# Altium project Red_Lion_Pro_ProjFile.PrjPcb
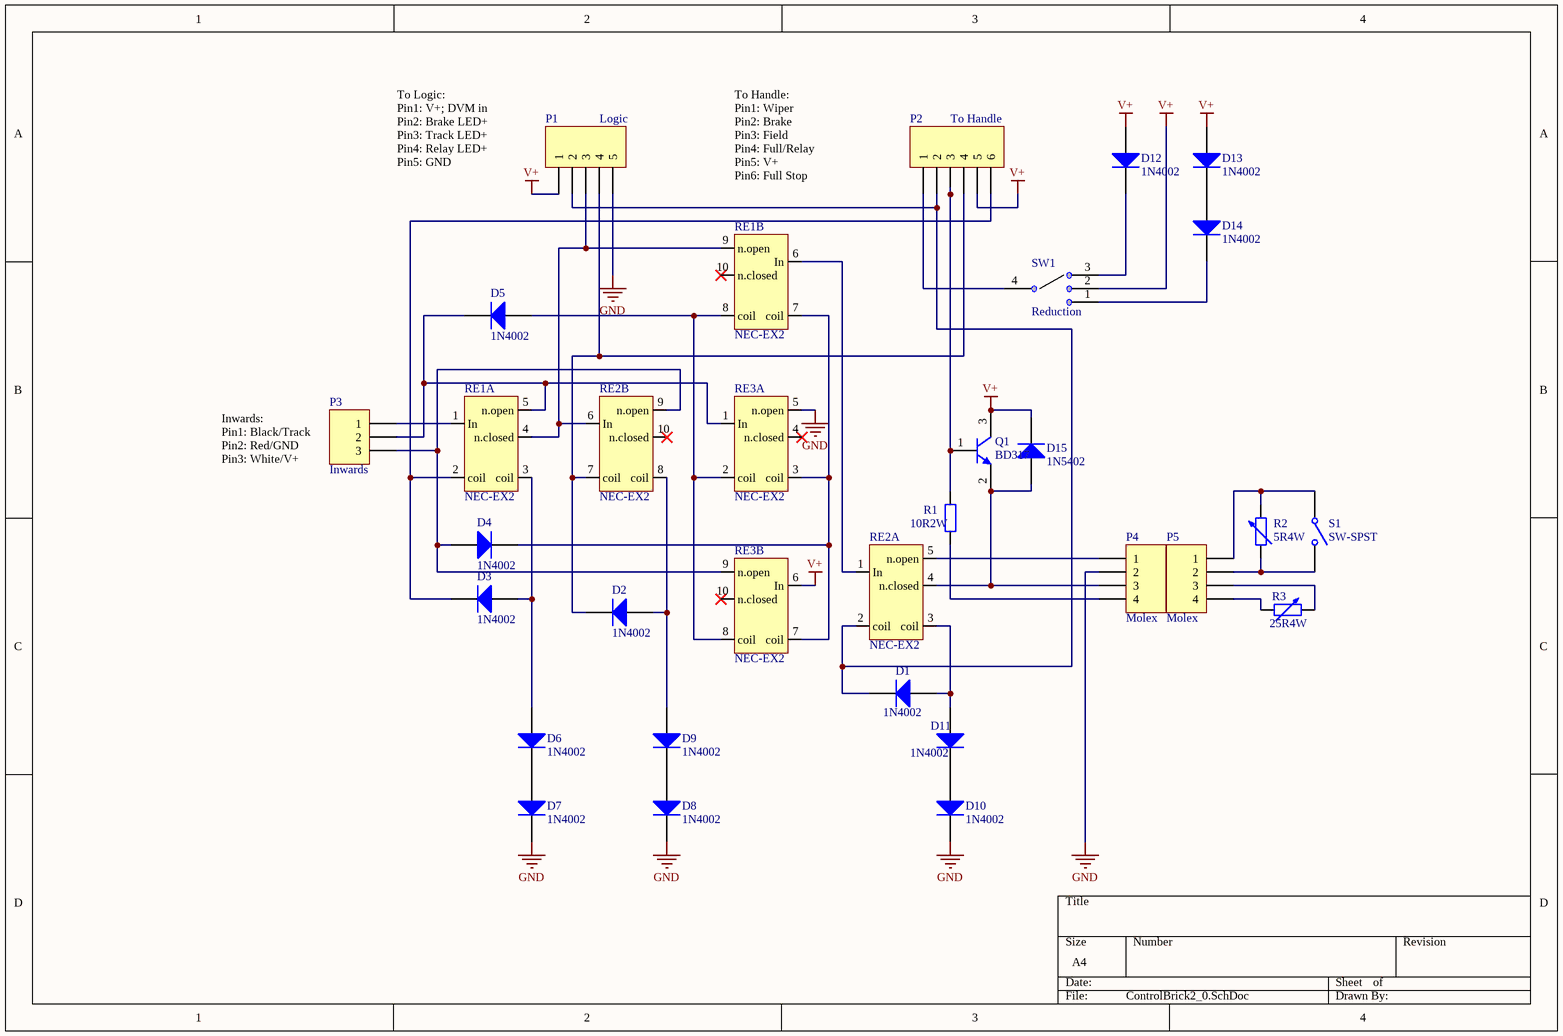
[diagram p0: ControlBrick2_0.SchDoc]
3 sheets, 103 parts. Net scope: global (net labels, ports and power ports of the same name join across sheets).
Board files: BaseBoard.PcbDoc, ControlBrick2_0.PcbDoc, ControlBrickFaceplate.PcbDoc, ControlBrickLogic2_0.PcbDoc, ControlBrickRiser.PcbDoc, Handle.PcbDoc, Holder.PcbDoc, ResistorCard32.5.PcbDoc, ResistorCard40.PcbDoc, ResistorCard50.PcbDoc, ResistorCard60.PcbDoc, ResistorCard67.5.PcbDoc, ResistorCard82.5.PcbDoc, ResistorCard97.5.PcbDoc, ResistorCard127.5.PcbDoc, ResistorCard140.PcbDoc, ResistorCard170.PcbDoc, ResistorCard187.5.PcbDoc, ResistorCard205.PcbDoc, ResistorCardAny.PcbDoc, Wiper.PcbDoc
Sheets:
  ControlBrick2_0.SchDoc
  ControlBrickLogic2_0.SchDoc
  Handle.SchDoc

## Sheet ControlBrick2_0.SchDoc
size A4

### Parts
D1  1N4002  [StdDiode]
D2  1N4002  [StdDiode]
D3  1N4002  [StdDiode]
D4  1N4002  [StdDiode]
D5  1N4002  [StdDiode]
D6  1N4002  [StdDiode]
D7  1N4002  [StdDiode]
D8  1N4002  [StdDiode]
D9  1N4002  [StdDiode]
D10  1N4002  [StdDiode]
D11  1N4002  [StdDiode]
D12  1N4002  [StdDiode]
D13  1N4002  [StdDiode]
D14  1N4002  [StdDiode]
D15  1N5402  [BigDiode]
P1  Logic  [HDR1X5]
P2  To Handle  [Interconnect]
P3  Inwards  [Inwards]
P4  Molex  [Molex_4x50.8]
P5  Molex  [HDR1X4]
Q1  BD317  [TO-3]
R1  10R2W  [2Wres]
R2  value 5R4W  [AXIAL-0.6]  (hidden comment: Res Adj2)
R3  value 25R4W  [AXIAL-0.6]  (hidden comment: Res Adj2)
RE1  NEC-EX2  [NEC-EX2]  (parts A,B of 2)
RE2  NEC-EX2  [NEC-EX2]  (parts A,B of 2)
RE3  NEC-EX2  [NEC-EX2]  (parts A,B of 2)
S1  SW-SPST  [Switch SPST]
SW1  Reduction  [Switch SP3T]

### Nets
GND: D7.2(K) D8.2(K) D10.2(K) P1.5 P4.2 RE3.5(n.open)
V+: D12.1(A) D13.1(A) D15.2(K) P1.1 P2.5 Q1.3(C) RE3.6(In) SW1.2
NetD1_1: D1.1(A) D11.1(A) RE2.3(coil)
NetD1_2: D1.2(K) P1.2 P2.2 RE2.2(coil)
NetD2_1: D2.1(A) D9.1(A) RE2.8(coil)
NetD2_2: D2.2(K) P1.4 P2.4 RE2.7(coil)
NetD3_1: D3.1(A) D6.1(A) RE1.3(coil)
NetD3_2: D3.2(K) P2.6 RE1.2(coil)
NetD4_1: D4.1(A) P3.3 RE2.9(n.open) RE3.9(n.open)
NetD4_2: D4.2(K) RE1.7(coil) RE3.3(coil) RE3.7(coil)
NetD5_1: D5.1(A) RE1.8(coil) RE3.2(coil) RE3.8(coil)
NetD5_2: D5.2(K) P3.2 RE1.5(n.open) RE3.1(In)
NetD6_2: D6.2(K) D7.1(A)
NetD8_1: D8.1(A) D9.2(K)
NetD10_1: D10.1(A) D11.2(K)
NetD12_2: D12.2(K) SW1.3
NetD13_2: D13.2(K) D14.1(A)
NetD14_2: D14.2(K) SW1.1
NetD15_1: D15.1(A) P4.3 Q1.2(E) RE2.4(n.closed)
NetP1_3: P1.3 RE1.4(n.closed) RE1.9(n.open) RE2.6(In)
NetP2_1: P2.1 SW1.4
NetP2_3: P2.3 Q1.1(B) R1.2
NetP3_1: P3.1 RE1.1(In)
NetP4_1: P4.1 RE2.5(n.open)
NetP4_4: P4.4 R1.1
NetP5_1: P5.1 R2.2 S1.1(COMMON)
NetP5_2: P5.2 R2.1 S1.2(NO)
NetP5_3: P5.3 R3.2
NetP5_4: P5.4 R3.1
NetRE1_6: RE1.6(In) RE2.1(In)

Not connected (* = marked no-connect by the designer): RE1 10(n.closed)*; RE2 10(n.closed)*; RE3 4(n.closed)* 10(n.closed)*

### Notes on the sheet
- (near P1) To Logic:
  Pin1: V+; DVM in
  Pin2: Brake LED+
  Pin3: Track LED+
  Pin4: Relay LED+
  Pin5: GND
- To Handle:
  Pin1: Wiper
  Pin2: Brake
  Pin3: Field
  Pin4: Full/Relay
  Pin5: V+
  Pin6: Full Stop
- Inwards:
  Pin1: Black/Track
  Pin2: Red/GND
  Pin3: White/V+

### Library data of the parts
D1-D14 = Diode 1N4002: 1 Amp General Purpose Rectifier; Published: 8-Jun-2000; LatestRevisionDate: 17-Jul-2002; LatestRevisionNote: Re-released for DXP Platform.; DatasheetVersion: 1998; PackageVersion: Aug-1999; PackageReference: DO-41; Publisher: Altium Limited; PackageDescription: Diode, Axial; Body 5.2 x 2.7 mm (LxDia. max), Lead Dia. 0.86 mm (max); Code_JEDEC: DO-204-AL; ComponentLink1Description: Manufacturer Link; ComponentLink1URL: http://www.fairchildsemi.com/; ComponentLink2Description: Datasheet; ComponentLink2URL: http://www.fairchildsemi.com/ds/1N%2F1N4001.pdf
D15 = Diode 1N5402: 3 Amp General Purpose Rectifier; Published: 8-Jun-2000; LatestRevisionDate: 17-Jul-2002; LatestRevisionNote: Re-released for DXP Platform.; DatasheetVersion: 1998; PackageVersion: Aug-1999; PackageReference: DO-201AD; Publisher: Altium Limited; PackageDescription: Diode, Axial; Body 9.5 x 5.6 mm (LxDia. max), Lead Dia. 1.32 mm (max); ComponentLink1Description: Manufacturer Link; ComponentLink1URL: http://www.fairchildsemi.com/; ComponentLink2Description: Datasheet; ComponentLink2URL: http://www.fairchildsemi.com/ds/1N%2F1N5400.pdf
P1 = Header 5: Header, 5-Pin; LatestRevisionDate: 17-Jul-2002; LatestRevisionNote: Re-released for DXP Platform.; Publisher: Altium Limited
P2 = Header 6: Header, 6-Pin; LatestRevisionDate: 17-Jul-2002; LatestRevisionNote: Re-released for DXP Platform.; Publisher: Altium Limited
P3 = Header 3: Header, 3-Pin; LatestRevisionDate: 17-Jul-2002; LatestRevisionNote: Re-released for DXP Platform.; Publisher: Altium Limited
P4 P5 = Header 4: Header, 4-Pin; LatestRevisionDate: 17-Jul-2002; LatestRevisionNote: Re-released for DXP Platform.; Publisher: Altium Limited
Q1 = 2N3904: NPN General Purpose Amplifier; Published: 8-Jun-2000; LatestRevisionDate: 15-Jan-2003; LatestRevisionNote: PCB Footprint 'BCY-W3/D4.7' replaced; DatasheetVersion: 1997; PackageVersion: Sep-1998; PackageReference: TO-92A; Publisher: Altium Limited; PackageDescription: TO, Flat Index; 3 In-Line, Axial Leads; Body Dia. 4.5mm; Leads 0.51 x 0.48 mm (max); ComponentLink1Description: Manufacturer Link; ComponentLink1URL: http://www.fairchildsemi.com/; ComponentLink2Description: Datasheet; ComponentLink2URL: http://www.fairchildsemi.com/ds/2N%2F2N3904.pdf
R1 = Res2: Resistor; Published: 8-Jun-2000; LatestRevisionDate: 17-Jul-2002; LatestRevisionNote: Re-released for DXP Platform.; PackageReference: AXIAL-0.4; Publisher: Altium Limited; PackageDescription: Axial Device, Thru-Hole; 2 Leads; 0.4 in Pin Spacing
R2 R3 = Res Adj2: Variable Resistor; Set Position: 0.5; Published: 8-Jun-2000; LatestRevisionDate: 17-Jul-2002; LatestRevisionNote: Re-released for DXP Platform.; PackageReference: AXIAL-0.6; Publisher: Altium Limited; PackageDescription: Axial Device, Thru-Hole; 2 Leads; 0.6 in Pin Spacing
RE1 RE2 = Component_2
RE3 = NEC-EX2-2U1S
S1 = SW-SPST: Single-Pole, Single-Throw Switch; Published: 24-Mar-1999; LatestRevisionDate: 17-Jul-2002; LatestRevisionNote: Re-released for DXP Platform.; PackageReference: SPST-2; Publisher: Altium Limited; PackageDescription: Switch; 2 Leads
SW1 = 3Way

## Sheet ControlBrickLogic2_0.SchDoc
size A4
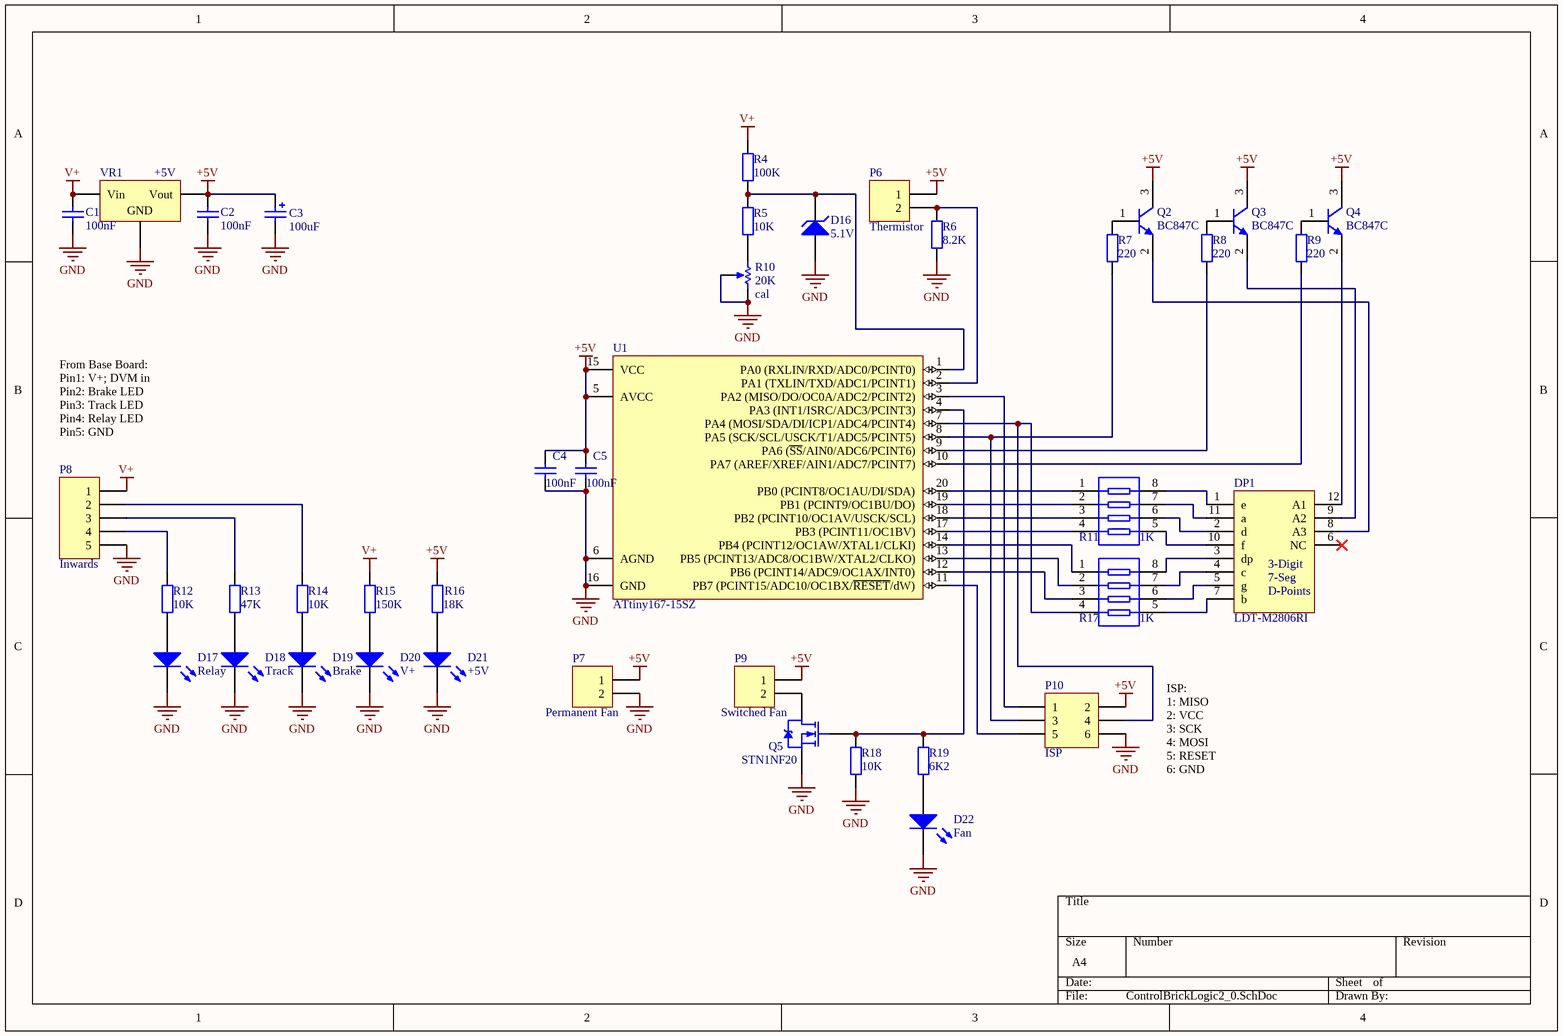
[diagram p1: ControlBrickLogic2_0.SchDoc]

### Parts
C1  value 100nF  [1206]  (hidden comment: CapSMD)
C2  value 100nF  [1206]  (hidden comment: CapSMD)
C3  value 100uF  [SMDcap 5mm]  (hidden comment: Supercap)
C4  value 100nF  [1206]  (hidden comment: CapSMD)
C5  value 100nF  [1206]  (hidden comment: CapSMD)
D16  5.1V  [MiniMELF]
D17  Relay  [LED 2.54]
D18  Track  [LED 2.54]
D19  Brake  [LED 2.54]
D20  V+  [LED 2.54]
D21  +5V  [LED 2.54]
D22  Fan  [LED 2.54]
DP1  LDT-M2806RI  [LDT-M2806RI]
P6  Thermistor  [HDR1X2]
P7  Permanent Fan  [HDR1X2]
P8  Inwards  [HDR1X5]
P9  Switched Fan  [HDR1X2]
P10  ISP  [HDR2X3]
Q2  BC847C  [SOT23]
Q3  BC847C  [SOT23]
Q4  BC847C  [SOT23]
Q5  STN1NF20  [SOT223]
R4  value 100K  [1206]  (hidden comment: ResSMD)
R5  value 10K  [1206]  (hidden comment: ResSMD)
R6  value 8.2K  [1206]  (hidden comment: ResSMD)
R7  value 220  [1206]  (hidden comment: ResSMD)
R8  value 220  [1206]  (hidden comment: ResSMD)
R9  value 220  [1206]  (hidden comment: ResSMD)
R10  cal  value 20K  [Tr3296P]
R11  1K  [ResNet1206_8]
R12  value 10K  [1206]  (hidden comment: ResSMD)
R13  value 47K  [1206]  (hidden comment: ResSMD)
R14  value 10K  [1206]  (hidden comment: ResSMD)
R15  value 150K  [1206]  (hidden comment: ResSMD)
R16  value 18K  [1206]  (hidden comment: ResSMD)
R17  1K  [ResNet1206_8]
R18  value 10K  [1206]  (hidden comment: ResSMD)
R19  value 6K2  [1206]  (hidden comment: ResSMD)
U1  ATtiny167-15SZ  [20TG_N]
VR1  +5V  [DPAK]

### Nets
+5V: C2.2 C3.1 C4.2 C5.2 P6.1 P7.1 P9.1 P10.2 Q2.3(C) Q3.3(C) Q4.3(C) R16.2 U1.5(AVCC) U1.15(VCC) VR1.3(Vout)
GND: C1.1 C2.1 C3.2 C4.1 C5.1 D16.1(A) D17.2(K) D18.2(K) D19.2(K) D20.2(K) D21.2(K) D22.2(K) P7.2 P8.5 P10.6 Q5.3(S) R6.1 R10.2(BOT) R10.3(TAP) R18.1 U1.6(AGND) U1.16(GND) VR1.2(GND)
V+: C1.2 P8.1 R4.2 R15.2 VR1.1(Vin)
NetD16_2: D16.2(K) R4.1 R5.2 U1.1(PA0_(RXLIN/RXD/ADC0/PCINT0))
NetD17_1: D17.1(A) R12.1
NetD18_1: D18.1(A) R13.1
NetD19_1: D19.1(A) R14.1
NetD20_1: D20.1(A) R15.1
NetD21_1: D21.1(A) R16.1
NetD22_1: D22.1(A) R19.1
NetDP1_1: DP1.1(e) R11.8
NetDP1_2: DP1.2(d) R11.6
NetDP1_3: DP1.3(dp) R17.8
NetDP1_4: DP1.4(c) R17.7
NetDP1_5: DP1.5(g) R17.6
NetDP1_7: DP1.7(b) R17.5
NetDP1_8: DP1.8(A3) Q2.2(E)
NetDP1_9: DP1.9(A2) Q3.2(E)
NetDP1_10: DP1.10(f) R11.5
NetDP1_11: DP1.11(a) R11.7
NetDP1_12: DP1.12(A1) Q4.2(E)
NetP6_2: P6.2 R6.2 U1.2(PA1_(TXLIN/TXD/ADC1/PCINT1))
NetP8_2: P8.2 R14.2
NetP8_3: P8.3 R13.2
NetP8_4: P8.4 R12.2
NetP9_2: P9.2 Q5.2(D)
NetP10_1: P10.1 U1.3(PA2_(MISO/DO/OC0A/ADC2/PCINT2))
NetP10_3: P10.3 R7.1 U1.8(PA5_(SCK/SCL/USCK/T1/ADC5/PCINT5))
NetP10_4: P10.4 R17.4 U1.7(PA4_(MOSI/SDA/DI/ICP1/ADC4/PCINT4))
NetP10_5: P10.5 U1.11(PB7_(PCINT15/ADC10/OC1BX/~{RESET}/dW))
NetQ2_1: Q2.1(B) R7.2
NetQ3_1: Q3.1(B) R8.2
NetQ4_1: Q4.1(B) R9.2
NetQ5_1: Q5.1(G) R18.2 R19.2 U1.4(PA3_(INT1/ISRC/ADC3/PCINT3))
NetR5_1: R5.1 R10.1(TOP)
NetR8_1: R8.1 U1.9(PA6_(~{SS}/AIN0/ADC6/PCINT6))
NetR9_1: R9.1 U1.10(PA7_(AREF/XREF/AIN1/ADC7/PCINT7))
NetR11_1: R11.1 U1.20(PB0_(PCINT8/OC1AU/DI/SDA))
NetR11_2: R11.2 U1.19(PB1_(PCINT9/OC1BU/DO))
NetR11_3: R11.3 U1.18(PB2_(PCINT10/OC1AV/USCK/SCL))
NetR11_4: R11.4 U1.17(PB3_(PCINT11/OC1BV))
NetR17_1: R17.1 U1.14(PB4_(PCINT12/OC1AW/XTAL1/CLKI))
NetR17_2: R17.2 U1.13(PB5_(PCINT13/ADC8/OC1BW/XTAL2/CLKO))
NetR17_3: R17.3 U1.12(PB6_(PCINT14/ADC9/OC1AX/INT0))

Not connected (* = marked no-connect by the designer): DP1 6(NC)*

### Notes on the sheet
- From Base Board:
  Pin1: V+; DVM in
  Pin2: Brake LED
  Pin3: Track LED
  Pin4: Relay LED
  Pin5: GND
- ISP:
  1: MISO
  2: VCC
  3: SCK
  4: MOSI
  5: RESET
  6: GND
- (in symbol 7Seg) 3-Digit; 7-Seg; D-Points

### Library data of the parts
C1 C2 C4 C5 = CapSMD: Capacitor; Published: 8-Jun-2000; LatestRevisionDate: 17-Jul-2002; LatestRevisionNote: Re-released for DXP Platform.; PackageReference: RAD-0.3; Publisher: Altium Limited; PackageDescription: Radial Cap, Thru-Hole; 2 Leads; 0.3 in Pin Spacing
C3 = Cap Pol2: Polarized Capacitor (Axial); Published: 8-Jun-2000; LatestRevisionDate: 17-Jul-2002; LatestRevisionNote: Re-released for DXP Platform.; PackageReference: POLAR0.8; Publisher: Altium Limited; PackageDescription: Polarized Capacitor; 2 Leads
D16 = D Zener: Zener Diode; Published: 8-Jun-2000; LatestRevisionDate: 17-Jul-2002; LatestRevisionNote: Re-released for DXP Platform.; PackageReference: DIODE-0.7; Publisher: Altium Limited; PackageDescription: Diode, Thru-Hole; 2 Leads; 0.7 in Pin Spacing
D17-D22 = LED1: Typical RED GaAs LED; Published: 8-Jun-2000; LatestRevisionDate: 08-Jul-2005; LatestRevisionNote: Mech Layer 1 removed.; PackageReference: LED-1; Publisher: Altium Limited; PackageDescription: LED; 2 Leads
DP1 = 7Seg
P6 P7 P9 = Header 2: Header, 2-Pin; LatestRevisionDate: 17-Jul-2002; LatestRevisionNote: Re-released for DXP Platform.; Publisher: Altium Limited
P8 = Header 5: Header, 5-Pin; LatestRevisionDate: 17-Jul-2002; LatestRevisionNote: Re-released for DXP Platform.; Publisher: Altium Limited
P10 = Header 3X2: Header, 3-Pin, Dual row; LatestRevisionDate: 17-Jul-2002; LatestRevisionNote: Re-released for DXP Platform.; Publisher: Altium Limited
Q2-Q4 = BC847C: NPN General Purpose Amplifier; Published: 8-Jun-2000; LatestRevisionDate: 15-Jan-2003; LatestRevisionNote: PCB Footprint 'BCY-W3/D4.7' replaced; DatasheetVersion: 1997; PackageVersion: Sep-1998; PackageReference: TO-92A; Publisher: Altium Limited; PackageDescription: TO, Flat Index; 3 In-Line, Axial Leads; Body Dia. 4.5mm; Leads 0.51 x 0.48 mm (max); ComponentLink1Description: Manufacturer Link; ComponentLink1URL: http://www.fairchildsemi.com/; ComponentLink2Description: Datasheet; ComponentLink2URL: http://www.fairchildsemi.com/ds/2N%2F2N3904.pdf
Q5 = STN1NF20: N-Channel MOSFET, SOT223; Note: Pin 2 is electrically connected to pin 4.; Published: 8-Jun-2000; LatestRevisionDate: 17-Jul-2002; LatestRevisionNote: Re-released for DXP Platform.; DatasheetVersion: PD-9.374G; PackageVersion: Feb-1997; PackageReference: TO-220AB; Publisher: Altium Limited; PackageDescription: TO, Thru-Hole, Vertical, Heatsink Mounted; 3 In-Line Leads; Pitch 2.54 mm; ComponentLink1Description: Manufacturer Link; ComponentLink1URL: http://www.irf.com/; ComponentLink2Description: Datasheet; ComponentLink2URL: http://www.irf.com/product-info/datasheets/data/irf640.pdf
R4-R9 R12-R16 R18 R19 = ResSMD: Resistor; Published: 8-Jun-2000; LatestRevisionDate: 17-Jul-2002; LatestRevisionNote: Re-released for DXP Platform.; PackageReference: AXIAL-0.4; Publisher: Altium Limited; PackageDescription: Axial Device, Thru-Hole; 2 Leads; 0.4 in Pin Spacing
R10 = RPot: Potentiometer; pin to pad: 1>2 2>1; Sim Note: Enter the Resistance value and the set point into parameter fields.; Set Position: 0.5; Published: 8-Jun-2000; LatestRevisionDate: 17-Jul-2002; LatestRevisionNote: Re-released for DXP Platform.; PackageReference: VR5; Publisher: Altium Limited; PackageDescription: Variable Resistor, Thru-Hole; 3 Leads
R11 R17 = ResNet4: Isolated Resistor Network
U1 = ATtiny167-15SZ: 8-bit Automotive AVR Microcontroller, 16KB Flash, 512 Bytes EEPROM, 512 Bytes SRAM, Automotive Grade (-40°C to +125°C), 20-Pin SOIC; Published: 1-Apr-2010; DatasheetVersion: revD, Jul-2009; PackageVersion: 2009; PackageReference: 20TG; Publisher: Altium Limited; PackageDescription: 20-pin, 0.300” Wide, Plastic Gull-Wing Small Outline (EIAJ SOIC); Supplier 1: Digi-Key; Supplier Part Number 1: ATTINY167-15SZ-ND; Supplier 2: Mouser; Supplier Part Number 2: 556-ATTINY167-15SZ; Code_JEDEC: MS-013-AC; Code_IPC: SOIC127P1030-20; ComponentLink1Description: Manufacturer Link; ComponentLink1URL: http://www.atmel.com/products/avr/default.asp?; ComponentLink2Description: ATtiny87/ATtiny167 Datasheet; ComponentLink2URL: http://www.atmel.com/dyn/resources/prod_documents/doc7728.pdf; ComponentLink3Description: Atmel.com Home; ComponentLink3URL: http://www.atmel.com
VR1 = Volt Reg: Voltage Regulator; Published: 24-Mar-1999; LatestRevisionDate: 29-May-2009; LatestRevisionNote: IPC-7351 Footprint Added.; PackageReference: D2PAK; Publisher: Altium Limited; PackageDescription: 3-Pin Transistor Outline Package 2.54 mm Pitch, 15.1 mm Lead Span

## Sheet Handle.SchDoc
size A4
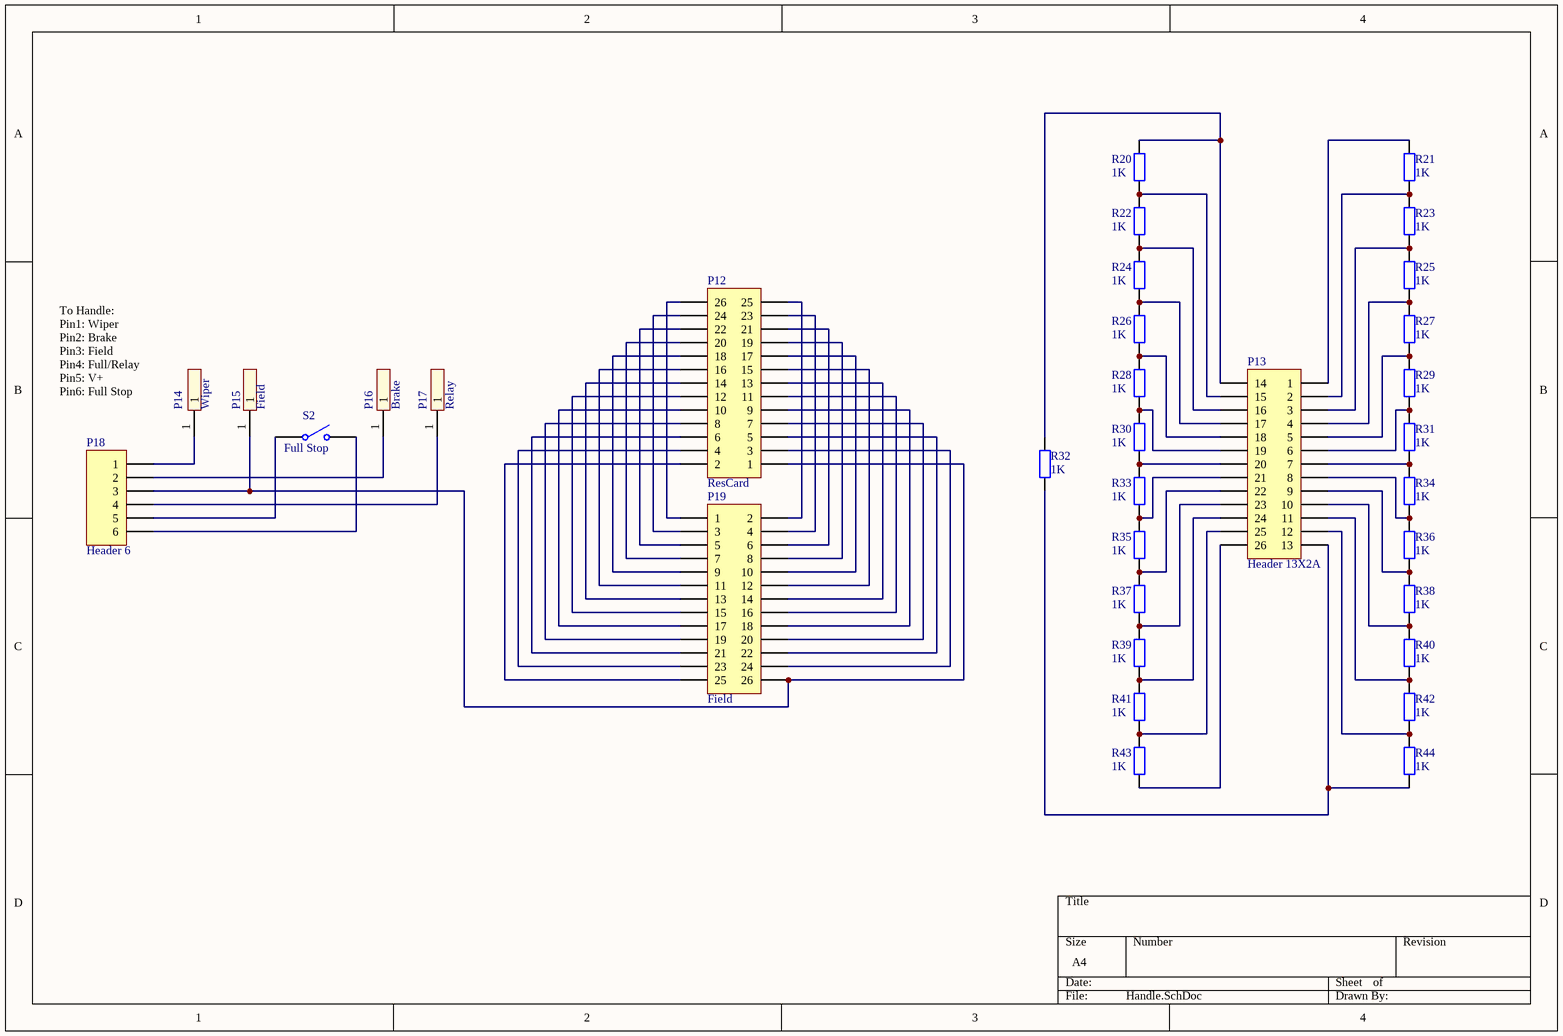
[diagram p2: Handle.SchDoc]

### Parts
P12  ResCard  [HDR2X13]
P13  Header 13X2A  [HDR2X13]
P14  Wiper  [1Pin]
P15  Field  [1Pin]
P16  Brake  [1Pin]
P17  Relay  [1Pin]
P18  Header 6  [Interconnect]
P19  Field  [Wiper Field]
R20  value 1K  [Res Linear]  (hidden comment: Res2)
R21  value 1K  [Res Linear]  (hidden comment: Res2)
R22  value 1K  [Res Linear]  (hidden comment: Res2)
R23  value 1K  [Res Linear]  (hidden comment: Res2)
R24  value 1K  [Res Linear]  (hidden comment: Res2)
R25  value 1K  [Res Linear]  (hidden comment: Res2)
R26  value 1K  [Res Linear]  (hidden comment: Res2)
R27  value 1K  [Res Linear]  (hidden comment: Res2)
R28  value 1K  [Res Linear]  (hidden comment: Res2)
R29  value 1K  [Res Linear]  (hidden comment: Res2)
R30  value 1K  [Res Linear]  (hidden comment: Res2)
R31  value 1K  [Res Linear]  (hidden comment: Res2)
R32  value 1K  [Res Linear]  (hidden comment: Res2)
R33  value 1K  [Res Linear]  (hidden comment: Res2)
R34  value 1K  [Res Linear]  (hidden comment: Res2)
R35  value 1K  [Res Linear]  (hidden comment: Res2)
R36  value 1K  [Res Linear]  (hidden comment: Res2)
R37  value 1K  [Res Linear]  (hidden comment: Res2)
R38  value 1K  [Res Linear]  (hidden comment: Res2)
R39  value 1K  [Res Linear]  (hidden comment: Res2)
R40  value 1K  [Res Linear]  (hidden comment: Res2)
R41  value 1K  [Res Linear]  (hidden comment: Res2)
R42  value 1K  [Res Linear]  (hidden comment: Res2)
R43  value 1K  [Res Linear]  (hidden comment: Res2)
R44  value 1K  [Res Linear]  (hidden comment: Res2)
S2  Full Stop  [HDR1X2]

### Nets
NetP12_1: P12.1 P15.1 P18.3 P19.26
NetP12_2: P12.2 P19.25
NetP12_3: P12.3 P19.24
NetP12_4: P12.4 P19.23
NetP12_5: P12.5 P19.22
NetP12_6: P12.6 P19.21
NetP12_7: P12.7 P19.20
NetP12_8: P12.8 P19.19
NetP12_9: P12.9 P19.18
NetP12_10: P12.10 P19.17
NetP12_11: P12.11 P19.16
NetP12_12: P12.12 P19.15
NetP12_13: P12.13 P19.14
NetP12_14: P12.14 P19.13
NetP12_15: P12.15 P19.12
NetP12_16: P12.16 P19.11
NetP12_17: P12.17 P19.10
NetP12_18: P12.18 P19.9
NetP12_19: P12.19 P19.8
NetP12_20: P12.20 P19.7
NetP12_21: P12.21 P19.6
NetP12_22: P12.22 P19.5
NetP12_23: P12.23 P19.4
NetP12_24: P12.24 P19.3
NetP12_25: P12.25 P19.2
NetP12_26: P12.26 P19.1
NetP13_1: P13.1 R21.1
NetP13_2: P13.2 R21.2 R23.1
NetP13_3: P13.3 R23.2 R25.1
NetP13_4: P13.4 R25.2 R27.1
NetP13_5: P13.5 R27.2 R29.1
NetP13_6: P13.6 R29.2 R31.1
NetP13_7: P13.7 R31.2 R34.1
NetP13_8: P13.8 R34.2 R36.1
NetP13_9: P13.9 R36.2 R38.1
NetP13_10: P13.10 R38.2 R40.1
NetP13_11: P13.11 R40.2 R42.1
NetP13_12: P13.12 R42.2 R44.1
NetP13_13: P13.13 R32.1 R44.2
NetP13_14: P13.14 R20.1 R32.2
NetP13_15: P13.15 R20.2 R22.1
NetP13_16: P13.16 R22.2 R24.1
NetP13_17: P13.17 R24.2 R26.1
NetP13_18: P13.18 R26.2 R28.1
NetP13_19: P13.19 R28.2 R30.1
NetP13_20: P13.20 R30.2 R33.1
NetP13_21: P13.21 R33.2 R35.1
NetP13_22: P13.22 R35.2 R37.1
NetP13_23: P13.23 R37.2 R39.1
NetP13_24: P13.24 R39.2 R41.1
NetP13_25: P13.25 R41.2 R43.1
NetP13_26: P13.26 R43.2
NetP14_1: P14.1 P18.1
NetP16_1: P16.1 P18.2
NetP17_1: P17.1 P18.4
NetP18_5: P18.5 S2.1(COMMON)
NetP18_6: P18.6 S2.2(NO)

### Notes on the sheet
- To Handle:
  Pin1: Wiper
  Pin2: Brake
  Pin3: Field
  Pin4: Full/Relay
  Pin5: V+
  Pin6: Full Stop

### Library data of the parts
P12 P19 = Header 13X2: Header, 13-Pin, Dual row; LatestRevisionDate: 17-Jul-2002; LatestRevisionNote: Re-released for DXP Platform.; Publisher: Altium Limited
P13 = Header 13X2A: Header, 13-Pin, Dual row; LatestRevisionDate: 17-Jul-2002; LatestRevisionNote: Re-released for DXP Platform.; Publisher: Altium Limited
P14 P16 P17 = Component_1
P15 = 1Pin
P18 = Header 6: Header, 6-Pin; LatestRevisionDate: 17-Jul-2002; LatestRevisionNote: Re-released for DXP Platform.; Publisher: Altium Limited
R20-R44 = Res2: Resistor; Published: 8-Jun-2000; LatestRevisionDate: 17-Jul-2002; LatestRevisionNote: Re-released for DXP Platform.; PackageReference: AXIAL-0.4; Publisher: Altium Limited; PackageDescription: Axial Device, Thru-Hole; 2 Leads; 0.4 in Pin Spacing
S2 = SW-SPST: Single-Pole, Single-Throw Switch; Published: 24-Mar-1999; LatestRevisionDate: 17-Jul-2002; LatestRevisionNote: Re-released for DXP Platform.; PackageReference: SPST-2; Publisher: Altium Limited; PackageDescription: Switch; 2 Leads

## Nets that join several sheets
GND: ControlBrick2_0 (6 pins), ControlBrickLogic2_0 (23 pins)
V+: ControlBrick2_0 (8 pins), ControlBrickLogic2_0 (5 pins)